# Altium schematic sheet principal.SchDoc
size 420 x 297 mm
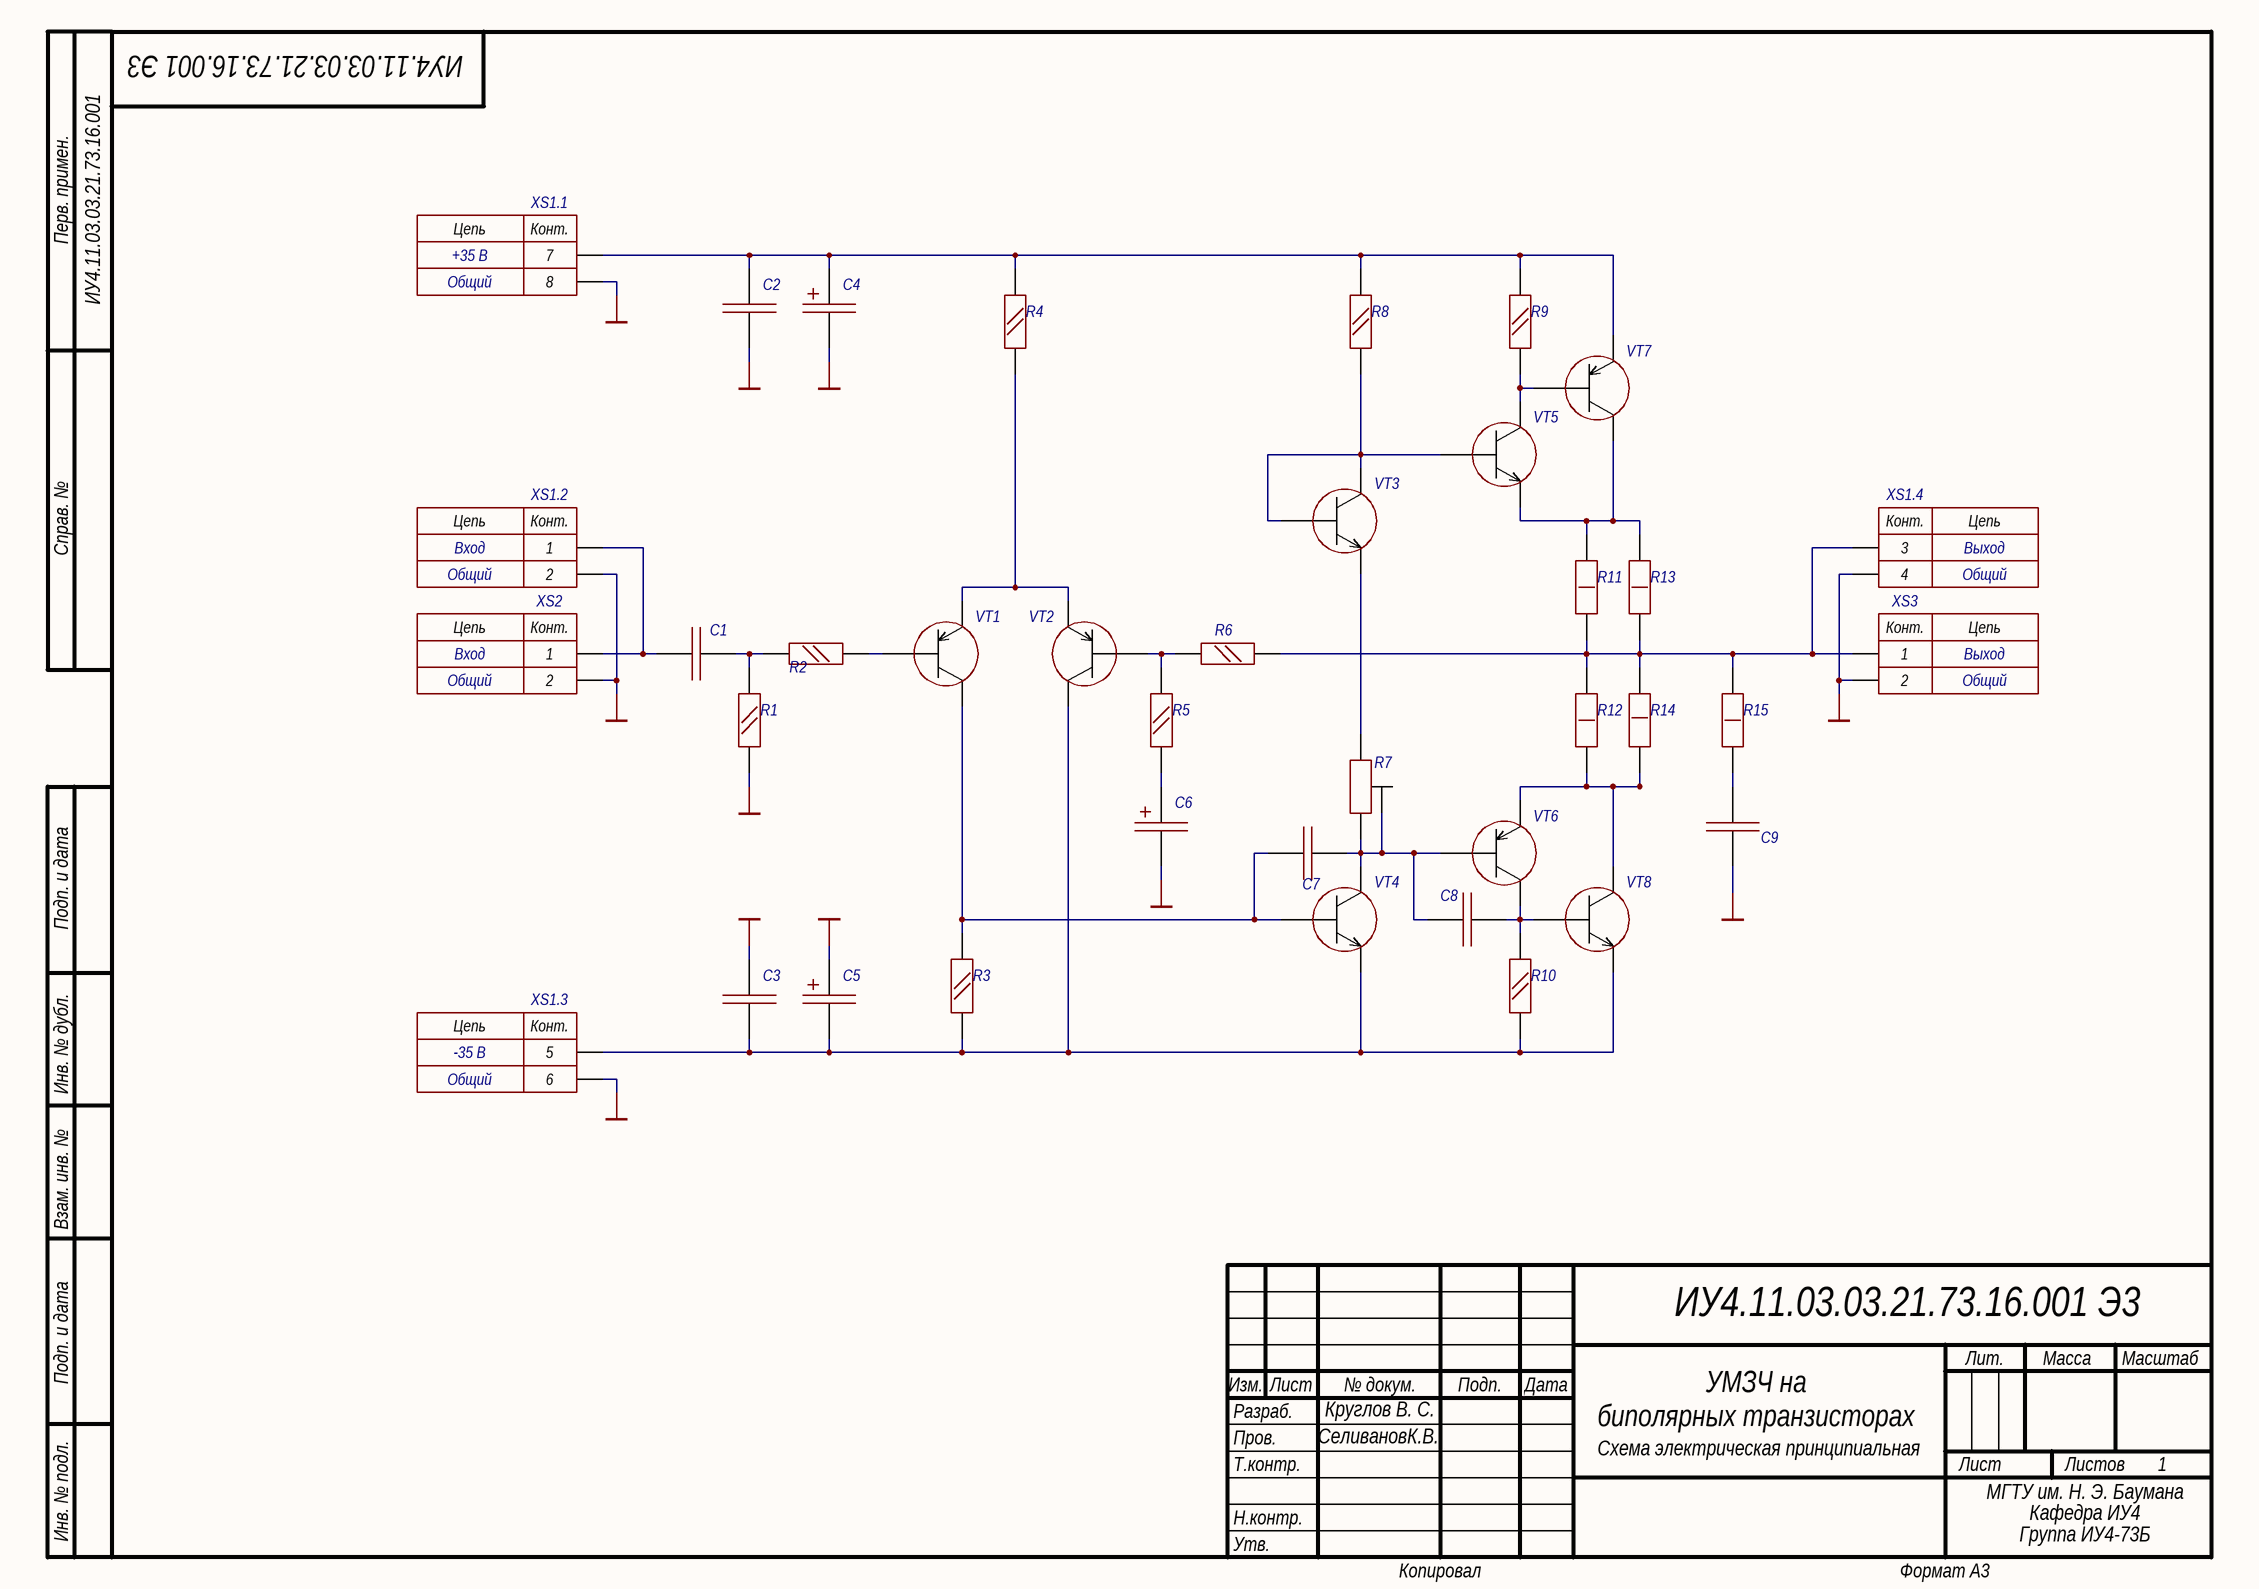
[diagram p0: principal.SchDoc]

## Parts
C1  Capacitor  [CAP: 0805]  (value not drawn)
C2  Capacitor  [CAP: 0805]  (value not drawn)
C3  Capacitor  [CAP: 0805]  (value not drawn)
C4  Capactor polar  [CAP: TANTAL-D]  (value not drawn)
C5  Capactor polar  [CAP: TANTAL-D]  (value not drawn)
C6  Capactor polar  [CAP: TANTAL-D]  (value not drawn)
C7  Capacitor  [CAP: 0805]  (value not drawn)
C8  Capacitor  [CAP: 0805]  (value not drawn)
C9  Capacitor  [CAP: 0805]  (value not drawn)
R1  Resistor  [RES: 0805]  (value not drawn)
R2  Resistor  [RES: 0805]  (value not drawn)
R3  Resistor  [RES: 0805]  (value not drawn)
R4  Resistor  [RES: 0805]  (value not drawn)
R5  Resistor  [RES: 0805]  (value not drawn)
R6  Resistor  [RES: 0805]  (value not drawn)
R7  POT  [POT_3296W]  (value not drawn)
R8  Resistor  [RES: 0805]  (value not drawn)
R9  Resistor  [RES: 0805]  (value not drawn)
R10  Resistor  [RES: 0805]  (value not drawn)
R11  Resistor  [RES: 2512]  (value not drawn)
R12  Resistor  [RES: 2512]  (value not drawn)
R13  Resistor  [RES: 2512]  (value not drawn)
R14  Resistor  [RES: 2512]  (value not drawn)
R15  Resistor  [RES: 2512]  (value not drawn)
VT1  Transistor_PNP  [TO92_3FB]  (value not drawn)
VT2  Transistor_PNP  [TO92_3FB]  (value not drawn)
VT3  BD139G  [TO126_3]  (value not drawn)
VT4  BD139G  [TO220_3]  (value not drawn)
VT5  BD139G  [TO126_3]  (value not drawn)
VT6  Transistor_PNP  [TO126_3]  (value not drawn)
VT7  Transistor_PNP  [TO247_3]  (value not drawn)
VT8  BD139G  [TO247_3]  (value not drawn)
XP1  CONN  [MOLEX_430450821]  (value not drawn)  (parts A,B,C,D of 4)
XS1  Audio  [FP-NMJ4HFD2-MFG]  (value not drawn)
XS2  Audio  [FP-NMJ4HFD2-MFG]  (value not drawn)

## Nets
GND: C2.1 C3.2 C4.1 C5.2 C6.1 C9.2 R1.2 XP1.2 XP1.4 XP1.6 XP1.8 XS1.2 XS2.2
NetC1_1: C1.1 XP1.1 XS1.1
NetC1_2: C1.2 R1.1 R2.1
NetC2_2: C2.2 C4.2 R4.1 R8.1 R9.2 VT7.1(E) XP1.7
NetC3_1: C3.1 C5.1 R3.2 R10.2 VT2.2(C) VT4.1(E) VT8.1(E) XP1.5
NetC6_2: C6.2 R5.2
NetC7_1: C7.1 R3.1 VT1.2(C) VT4.3(B)
NetC7_2: C7.2 C8.1 R7.2 R7.3 VT4.2(C) VT6.3(B)
NetC8_2: C8.2 R10.1 VT6.2(C) VT8.3(B)
NetC9_1: C9.1 R15.2
NetR2_2: R2.2 VT1.3(B)
NetR4_2: R4.2 VT1.1(E) VT2.1(E)
NetR5_1: R5.1 R6.1 VT2.3(B)
NetR6_2: R6.2 R11.2 R12.1 R13.2 R14.1 R15.1 XP1.3 XS2.1
NetR7_1: R7.1 VT3.1(E)
NetR8_2: R8.2 VT3.2(C) VT3.3(B) VT5.3(B)
NetR9_1: R9.1 VT5.2(C) VT7.3(B)
NetR11_1: R11.1 R13.1 VT5.1(E) VT7.2(C)
NetR12_2: R12.2 R14.2 VT6.1(E) VT8.2(C)

## Notes on the sheet
- ИУ4.11.03.03.21.73.16.001 Э3
- ИУ4.11.03.03.21.73.16.001
- +35 В
- (near XP1) XS1.1
- Общий
- (near XP1) XS1.2
- (near XP1) XS1.4
- Вход
- (near XP1) XS2
- (near XP1) XS3
- Выход
- (near XP1) XS1.3
- -35 В
- Круглов В. С.
- СеливановК.В.
- УМЗЧ на
  биполярных транзисторах
- Схема электрическая принципиальная
- МГТУ им. Н. Э. Баумана
- Кафедра ИУ4
- Группа ИУ4-73Б
- Перв. примен.
- Справ. №
- Подп. и дата
- Инв. № дубл.
- Взам. инв. №
- Разраб.
- Изм.
- Лист
- № докум.
- Подп.
- Дата
- Лит.
- Масса
- Масштаб
- Пров.
- Т.контр.
- Листов
- 1
- Инв. № подл.
- Утв.
- Н.контр.
- Копировал
- Формат А3
- (in symbol Audio) Конт.; Цепь
- (in symbol CONN, part A) Цепь; Конт.
- (in symbol CONN, part B) Конт.; Цепь
- (in symbol CONN, part C) Цепь; Конт.
- (in symbol CONN, part D) Цепь; Конт.

## Library data of the parts
R1-R6 R8-R15 = Resistor: Power Rating: 1W; Temperature Coefficient: 200ppm/°C; Tolerance: 5%; Voltage Rating (DC): 200V; Resistance: 51R; Width: 0.126inch; Case/Package: 2512; Series: MCR; Min Operating Temperature: -55°C; Mount: Surface Mount; Number of Terminations: 2; RoHS Compliant: Yes; Height: 0.028inch; Case Code (Metric): 6432; Length: 0.248inch; Packaging: Tape and Reel; Max Power Dissipation: 1W; Package Quantity: 1; Max Operating Temperature: 125°C; Lead Free: Lead Free; Case Code (Imperial): 2512; Resistor Type: Thick Film; Size Code: 2512
VT3-VT5 VT8 = Transistor_NPN: NexarPartId: 354669; Manufacturer Lifecycle Status: ACTIVE; Collector Emitter Saturation Voltage: 500mV; Collector Emitter Breakdown Voltage: 80V; hFE Min: 25; Element Configuration: Single; Max Power Dissipation: 1.25W; Max Junction Temperature (Tj): 150°C; Emitter Base Voltage (VEBO): 5V; Max Collector Current: 1.5A; Number of Elements: 1; Polarity: NPN; Min Operating Temperature: -55°C; Max Operating Temperature: 150°C; Voltage Rating (DC): 80V; REACH SVHC: No SVHC; Radiation Hardening: No; Contact Plating: Tin; Schedule B: 8541290080, 8541290080|8541290080, 8541290080|8541290080|8541290080, 8541290080|8541290080|8541290080|8541290080; Number of Pins: 3; Case/Package: TO-225; Lifecycle Status: Production; Collector Base Voltage (VCBO): 80V; Weight: 4.535924g; Height: 11.04mm; RoHS: Compliant; Width: 2.66mm; Collector Emitter Voltage (VCEO): 80V; Lead Free: Lead Free; Current Rating: 1.5A; Power Dissipation: 1.25W; Packaging: Bulk; Length: 7.74mm